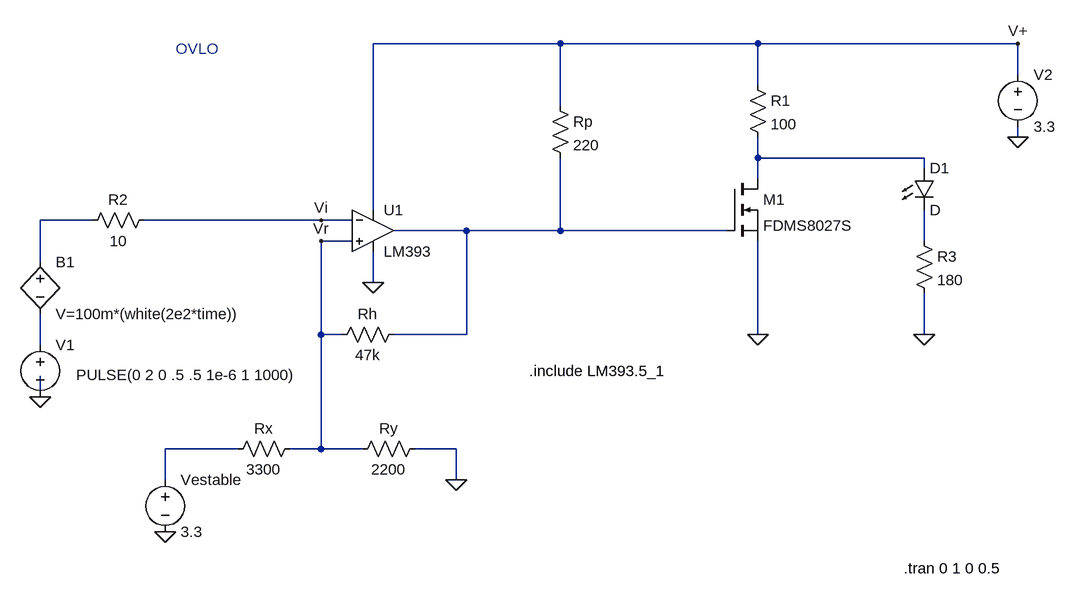
[diagram p0: schematic OVLO.asc]
OVLO.asc, the LTspice schematic file:
Version 4
SHEET 1 1336 1092
WIRE -2640 64 -2928 64
WIRE -2336 64 -2640 64
WIRE -1936 64 -2336 64
WIRE -1936 112 -1936 64
WIRE -2336 128 -2336 64
WIRE -2640 160 -2640 64
WIRE -1936 208 -1936 192
WIRE -2336 240 -2336 208
WIRE -2080 240 -2336 240
WIRE -2080 256 -2080 240
WIRE -2336 272 -2336 240
WIRE -2928 320 -2928 64
WIRE -3360 336 -3440 336
WIRE -3008 336 -3280 336
WIRE -2960 336 -3008 336
WIRE -2784 352 -2896 352
WIRE -2640 352 -2640 240
WIRE -2640 352 -2784 352
WIRE -2384 352 -2640 352
WIRE -2960 368 -3008 368
WIRE -2080 368 -2080 320
WIRE -3440 400 -3440 336
WIRE -2928 432 -2928 384
WIRE -3008 512 -3008 368
WIRE -2976 512 -3008 512
WIRE -2784 512 -2784 352
WIRE -2784 512 -2896 512
WIRE -2336 512 -2336 368
WIRE -2080 512 -2080 448
WIRE -3440 528 -3440 480
WIRE -3440 608 -3440 576
WIRE -3136 688 -3248 688
WIRE -3008 688 -3008 512
WIRE -3008 688 -3056 688
WIRE -2944 688 -3008 688
WIRE -2800 688 -2864 688
WIRE -3248 736 -3248 688
WIRE -2800 736 -2800 688
FLAG -1936 208 0
FLAG -3440 608 0
FLAG -2928 432 0
FLAG -3248 816 0
FLAG -2800 736 0
FLAG -2336 512 0
FLAG -3008 368 Vr
FLAG -3008 336 Vi
FLAG -1936 64 V+
FLAG -2080 512 0
SYMBOL voltage -3440 512 R0
WINDOW 3 55 62 Left 2
WINDOW 123 0 0 Left 0
WINDOW 39 0 0 Left 0
SYMATTR Value PULSE(0 2 0 .5 .5 1e-6 1 1000)
SYMATTR InstName V1
SYMBOL voltage -1936 96 R0
WINDOW 123 0 0 Left 0
WINDOW 39 0 0 Left 0
SYMATTR InstName V2
SYMATTR Value 3.3
SYMBOL res -2656 144 R0
SYMATTR InstName Rp
SYMATTR Value 220
SYMBOL voltage -3248 720 R0
SYMATTR InstName Vestable
SYMATTR Value 3.3
SYMBOL res -3152 704 R270
WINDOW 0 32 56 VTop 2
WINDOW 3 0 56 VBottom 2
SYMATTR InstName Rx
SYMATTR Value 3300
SYMBOL res -2960 704 R270
WINDOW 0 32 56 VTop 2
WINDOW 3 0 56 VBottom 2
SYMATTR InstName Ry
SYMATTR Value 2200
SYMBOL res -2880 496 R90
WINDOW 0 0 56 VBottom 2
WINDOW 3 32 56 VTop 2
SYMATTR InstName Rh
SYMATTR Value 47k
SYMBOL res -3264 320 R90
WINDOW 0 0 56 VBottom 2
WINDOW 3 32 56 VTop 2
SYMATTR InstName R2
SYMATTR Value 10
SYMBOL nmos -2384 272 R0
SYMATTR InstName M1
SYMATTR Value FDMS8027S
SYMBOL LED -2096 256 R0
SYMATTR InstName D1
SYMBOL res -2352 112 R0
SYMATTR InstName R1
SYMATTR Value 100
SYMBOL bv -3440 384 R0
SYMATTR InstName B1
SYMATTR Value V=100m*(white(2e2*time))
SYMBOL res -2096 352 R0
SYMATTR InstName R3
SYMATTR Value 180
SYMBOL OpAmps\\opamp2 -2928 288 R0
SYMATTR InstName U1
SYMATTR Value LM393
TEXT -2112 872 Left 2 !.tran 0 1 0 0.5
TEXT -3232 72 Left 2 ;OVLO
TEXT -2688 568 Left 2 !.include LM393.5_1

The netlist it stands for:
* OVLO.asc
V1 N005 0 PULSE(0 2 0 .5 .5 1e-6 1 1000)
V2 V+ 0 3.3
Rp V+ N003 220
Vestable N006 0 3.3
Rx N006 Vr 3300
Ry Vr 0 2200
Rh N003 Vr 47k
R2 Vi N002 10
M1 N001 N003 0 0 FDMS8027S
D1 N001 N004 D
R1 V+ N001 100
B1 N002 N005 V=100m*(white(2e2*time))
R3 N004 0 180
XU1 Vr Vi V+ 0 N003 LM393  ; pins In+ In- V+ V- OUT
.model D D
.lib standard.dio
.model NMOS NMOS
.model PMOS PMOS
.lib standard.mos
.tran 0 1 0 0.5
* OVLO
.include LM393.5_1
.backanno
.end